# Altium schematic sheet 05_Power Sequence.SchDoc
size A3
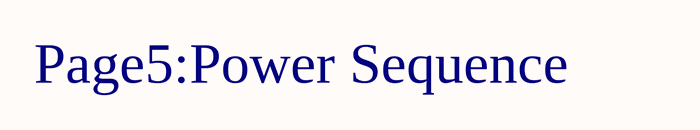
[diagram p0: 05_Power Sequence.SchDoc]

## Notes on the sheet
- Page5:Power Sequence
- Drawn by
- Project
- Title
- Version
- Sheet of
- Date